# Altium schematic sheet TFT.SchDoc
size A4; Organization: Altium Limited; Address1: L3, 12a Rodborough Rd; Address2: Frenchs Forest; Address3: NSW; Address4: Australia 2086
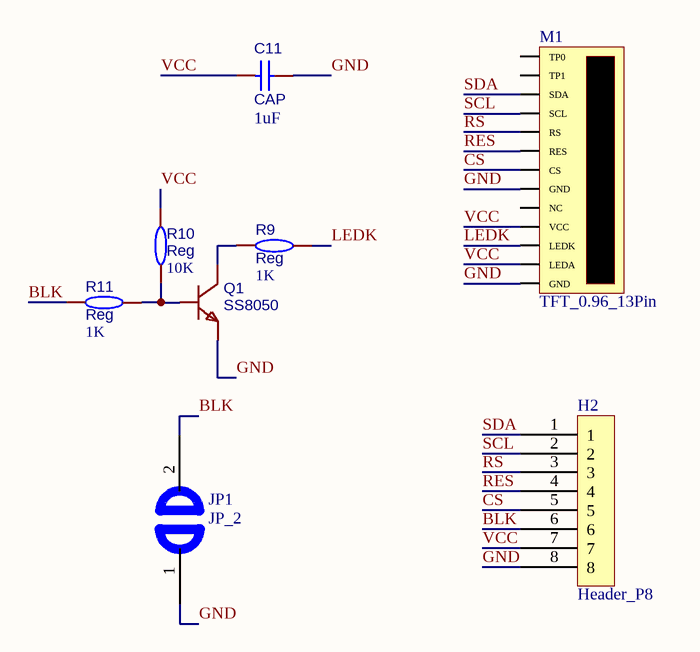
[diagram p0: TFT.SchDoc]

## Parts
C11  CAP  value 1uF  [C0603]
H2  Header_P8  [H_2.54_P8]
JP1  JP_2  [JP_2Pin]
M1  TFT_0.96_13Pin  [TFT_0.96_13Pin]
Q1  SS8050  [SOT-23-3]
R9  Reg  value 1K  [R0603]
R10  Reg  value 10K  [R0603]
R11  Reg  value 1K  [R0603]

## Nets
BLK: H2.6 JP1.2 R11.1
CS: H2.5 M1.7(CS)
GND: C11.2 H2.8 JP1.1 M1.8(GND) M1.13(GND) Q1.2(E)
LEDK: M1.11(LEDK) R9.2
RES: H2.4 M1.6(RES)
RS: H2.3 M1.5(RS)
SCL: H2.2 M1.4(SCL)
SDA: H2.1 M1.3(SDA)
VCC: C11.1 H2.7 M1.10(VCC) M1.12(LEDA) R10.2
NetQ1_1: Q1.1(B) R10.1 R11.2
NetQ1_3: Q1.3(C) R9.1

Not connected (* = marked no-connect by the designer): M1 1(TP0) 2(TP1) 9(NC)

## Notes on the sheet
- Title
- Size:
- Date:
- A4
- Number:
- Time:
- Revision:
- Sheet
- of
- File:

## Library data of the parts
C11 = CAP: BOM_Manufacturer: Huaxin S&T; BOM_Manufacturer Part: 0603B103K101CT; nameAlias: Capacitance; Contributor: LCSC; BOM_Supplier: LCSC; BOM_Supplier Part: C302008; spicePre: C; spiceSymbolName: 0603B103K101CT
H2 = Header_P8: 8Pin排针
JP1 = JP_2: 2Pin跳线焊盘
M1 = TFT_0.96_13Pin: ST7735_TFT
Q1 = SS8050: NPN; BOM_Manufacturer: AnBon; Contributor: LCSC; BOM_Paste Type: recommend; BOM_Supplier: LCSC; BOM_Supplier Part: C541705; BOM_Manufacturer Part: SS8050; spicePre: Q; spiceSymbolName: SS8050_C541705
R9-R11 = Res: 电阻; BOM_Manufacturer: Viking Tech; BOM_Manufacturer Part: AR03BTCX1002A; nameAlias: Resistance (Ohms); Contributor: LCSC; BOM_Supplier: LCSC; BOM_Supplier Part: C465721; spicePre: R; spiceSymbolName: AR03BTCX1002A